# Altium project MiniSTM32.PrjPcb
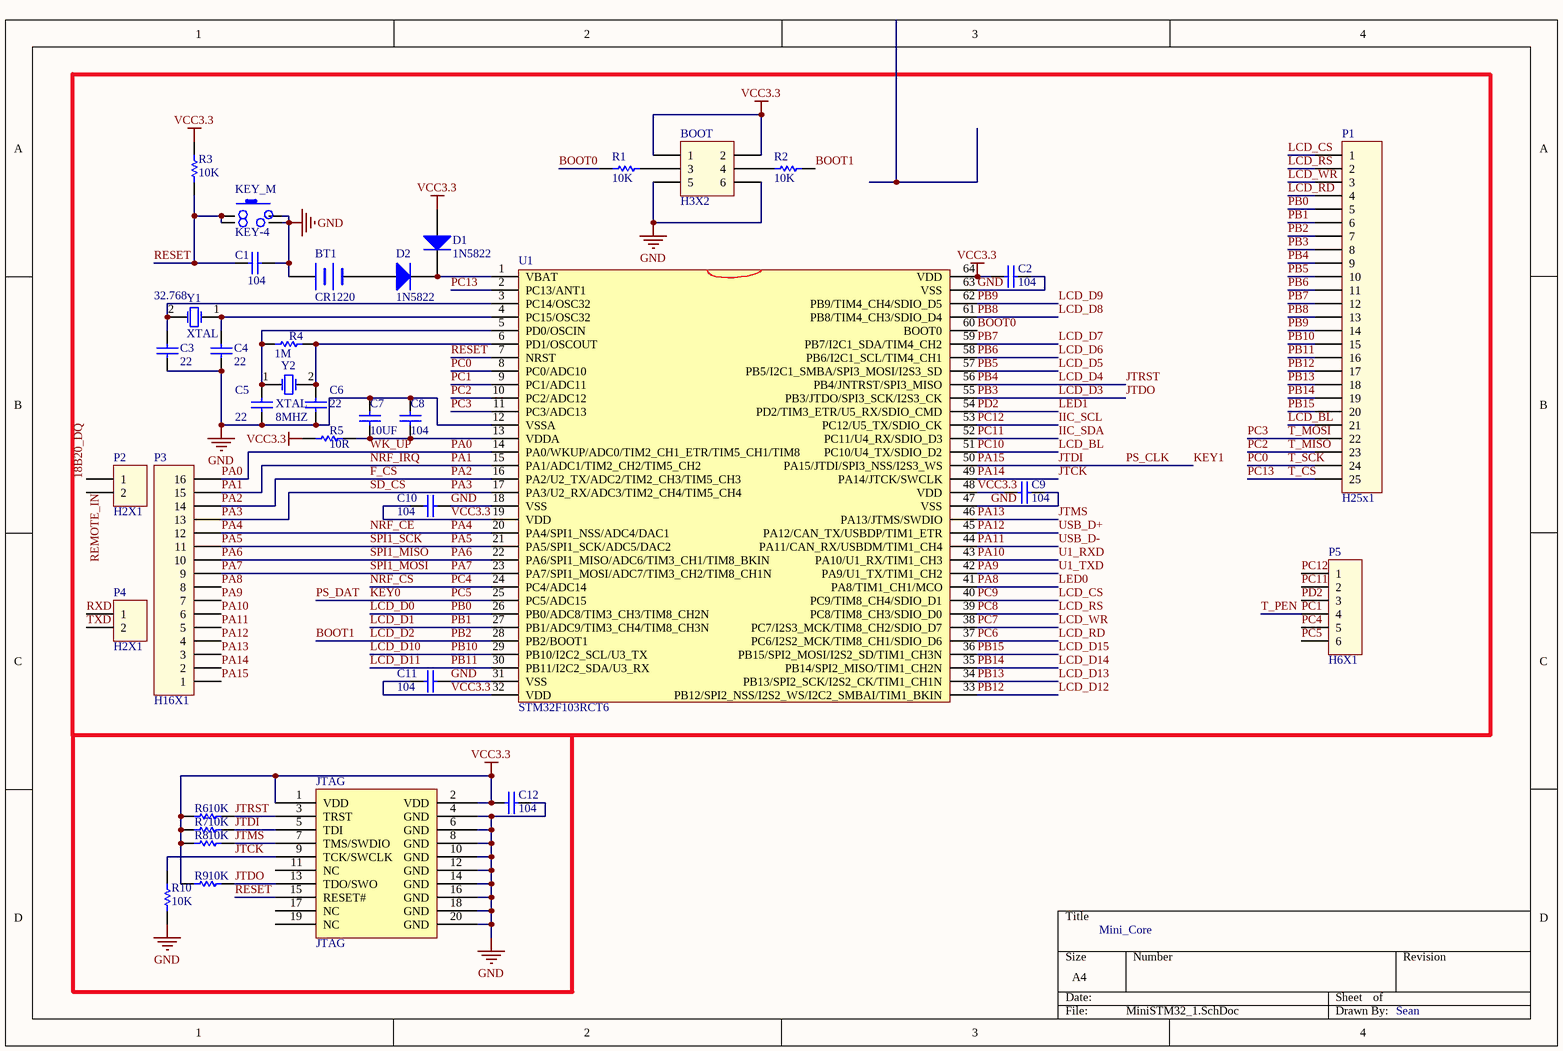
[diagram p0: MiniSTM32_1.SchDoc]
2 sheets, 104 parts. Net scope: global (net labels, ports and power ports of the same name join across sheets).
Board file: MiniSTM32.PcbDoc
Sheets:
  MiniSTM32_1.SchDoc
  MiniSTM32_2.SchDoc

## Sheet MiniSTM32_1.SchDoc: Mini_Core
size A4; DrawnBy: Sean

### Parts
BOOT  H3X2  [H2.54-2X3]
BT1  CR1220  [CR1220]
C1  Cap  [CAP[0603]]  (value not drawn)
C2  Cap  [CAP[0603]]  (value not drawn)
C3  Cap  [CAP[0603]]  (value not drawn)
C4  Cap  [CAP[0603]]  (value not drawn)
C5  Cap  [CAP[0805]]  (value not drawn)
C6  Cap  [CAP[0805]]  (value not drawn)
C7  Cap  [CAP[1206]]  (value not drawn)
C8  Cap  [CAP[0603]]  (value not drawn)
C9  Cap  [CAP[0603]]  (value not drawn)
C10  Cap  [CAP[0603]]  (value not drawn)
C11  Cap  [CAP[0603]]  (value not drawn)
C12  Cap  [CAP[0603]]  (value not drawn)
D1  1N5822  [1N4733]
D2  1N5822  [1N4733]
JTAG  JTAG  [JTAG]
KEY_M  KEY-4  [KEY-4(DIP)]
P1  H25x1  [H2.54-1X25]
P2  H2X1  [H2.54-1X2]
P3  H16X1  [H2.54-1X16]
P4  H2X1  [H2.54-1X2]
P5  H6X1  [H2.54-1X6]
R1  Res  [RES[0603]]  (value not drawn)
R2  Res  [RES[0603]]  (value not drawn)
R3  Res  [RES[0603]]  (value not drawn)
R4  Res  [RES[0603]]  (value not drawn)
R5  Res  [RES[0603]]  (value not drawn)
R6  Res  [RES[0603]]  (value not drawn)
R7  Res  [RES[0603]]  (value not drawn)
R8  Res  [RES[0603]]  (value not drawn)
R9  Res  [RES[0603]]  (value not drawn)
R10  Res  [RES[0603]]  (value not drawn)
U1  STM32F103RCT6  [LQFP-64]
Y1  XTAL  [XTAL-32768_2]
Y2  XTAL  [XTAL]

### Nets
GND: BOOT.5 BOOT.6 BT1.1(+) C1.2 C2.2 C3.1 C4.1 C5.1 C6.1 C7.2 C8.2 C9.2 C10.1 C11.1 C12.1 JTAG.4(GND) JTAG.6(GND) JTAG.8(GND) JTAG.10(GND) JTAG.12(GND) JTAG.14(GND) JTAG.16(GND) JTAG.18(GND) JTAG.20(GND) KEY_M.3 KEY_M.4 R10.2 U1.12(VSSA) U1.18(VSS) U1.31(VSS) U1.47(VSS) U1.63(VSS)
VCC3.3: BOOT.1 BOOT.2 C2.1 C9.1 C10.2 C11.2 C12.2 D1.1(A) JTAG.1(VDD) JTAG.2(VDD) R3.2 R5.2 R6.2 R7.2 R8.2 R9.2 U1.19(VDD) U1.32(VDD) U1.48(VDD) U1.64(VDD)
18B20_DQ: P2.1
BOOT0: R1.1 U1.60(BOOT0)
BOOT1: P1.7 R2.2 U1.28(PB2/BOOT1)  [also labelled LCD_D2, PB2]
F_CS: P3.14 U1.16(PA2/U2_TX/ADC2/TIM2_CH3/TIM5_CH3)  [also labelled PA2]
IIC_SCL: P5.1 U1.53(PC12/U5_TX/SDIO_CK)  [also labelled PC12]
IIC_SDA: P5.2 U1.52(PC11/U4_RX/SDIO_D3)  [also labelled PC11]
JTCK: JTAG.9(TCK/SWCLK) P3.2 R10.1 U1.49(PA14/JTCK/SWCLK)  [also labelled PA14]
JTDI: JTAG.5(TDI) P3.1 R7.1 U1.50(PA15/JTDI/SPI3_NSS/I2S3_WS)  [also labelled KEY1, PA15, PS_CLK]
JTDO: JTAG.13(TDO/SWO) P1.8 R9.1 U1.55(PB3/JTDO/SPI3_SCK/I2S3_CK)  [also labelled LCD_D3, PB3]
JTMS: JTAG.7(TMS/SWDIO) P3.3 R8.1 U1.46(PA13/JTMS/SWDIO)  [also labelled PA13]
JTRST: JTAG.3(TRST) P1.9 R6.1 U1.56(PB4/JNTRST/SPI3_MISO)  [also labelled LCD_D4, PB4]
KEY0: P5.6 U1.25(PC5/ADC15)  [also labelled PC5, PS_DAT]
LCD_BL: P1.21 U1.51(PC10/U4_TX/SDIO_D2)  [also labelled PC10]
LCD_CS: P1.1 U1.40(PC9/TIM8_CH4/SDIO_D1)  [also labelled PC9]
LCD_D0: P1.5 U1.26(PB0/ADC8/TIM3_CH3/TIM8_CH2N)  [also labelled PB0]
LCD_D1: P1.6 U1.27(PB1/ADC9/TIM3_CH4/TIM8_CH3N)  [also labelled PB1]
LCD_D5: P1.10 U1.57(PB5/I2C1_SMBA/SPI3_MOSI/I2S3_SD)  [also labelled PB5]
LCD_D6: P1.11 U1.58(PB6/I2C1_SCL/TIM4_CH1)  [also labelled PB6]
LCD_D7: P1.12 U1.59(PB7/I2C1_SDA/TIM4_CH2)  [also labelled PB7]
LCD_D8: P1.13 U1.61(PB8/TIM4_CH3/SDIO_D4)  [also labelled PB8]
LCD_D9: P1.14 U1.62(PB9/TIM4_CH4/SDIO_D5)  [also labelled PB9]
LCD_D10: P1.15 U1.29(PB10/I2C2_SCL/U3_TX)  [also labelled PB10]
LCD_D11: P1.16 U1.30(PB11/I2C2_SDA/U3_RX)  [also labelled PB11]
LCD_D12: P1.17 U1.33(PB12/SPI2_NSS/I2S2_WS/I2C2_SMBAI/TIM1_BKIN)  [also labelled PB12]
LCD_D13: P1.18 U1.34(PB13/SPI2_SCK/I2S2_CK/TIM1_CH1N)  [also labelled PB13]
LCD_D14: P1.19 U1.35(PB14/SPI2_MISO/TIM1_CH2N)  [also labelled PB14]
LCD_D15: P1.20 U1.36(PB15/SPI2_MOSI/I2S2_SD/TIM1_CH3N)  [also labelled PB15]
LCD_RD: P1.4 U1.37(PC6/I2S2_MCK/TIM8_CH1/SDIO_D6)  [also labelled PC6]
LCD_RS: P1.2 U1.39(PC8/TIM8_CH3/SDIO_D0)  [also labelled PC8]
LCD_WR: P1.3 U1.38(PC7/I2S3_MCK/TIM8_CH2/SDIO_D7)  [also labelled PC7]
LED0: P3.8 U1.41(PA8/TIM1_CH1/MCO)  [also labelled PA8]
LED1: P5.3 U1.54(PD2/TIM3_ETR/U5_RX/SDIO_CMD)  [also labelled PD2]
NRF_CE: P3.12 U1.20(PA4/SPI1_NSS/ADC4/DAC1)  [also labelled PA4]
NRF_CS: P5.5 U1.24(PC4/ADC14)  [also labelled PC4]
NRF_IRQ: P3.15 U1.15(PA1/ADC1/TIM2_CH2/TIM5_CH2)  [also labelled PA1]
PA0: P3.16 U1.14(PA0/WKUP/ADC0/TIM2_CH1_ETR/TIM5_CH1/TIM8)  [also labelled WK_UP]
PA3: P3.13 U1.17(PA3/U2_RX/ADC3/TIM2_CH4/TIM5_CH4)  [also labelled SD_CS]
PA5: P3.11 U1.21(PA5/SPI1_SCK/ADC5/DAC2)  [also labelled SPI1_SCK]
PA6: P3.10 U1.22(PA6/SPI1_MISO/ADC6/TIM3_CH1/TIM8_BKIN)  [also labelled SPI1_MISO]
PA7: P3.9 U1.23(PA7/SPI1_MOSI/ADC7/TIM3_CH2/TIM8_CH1N)  [also labelled SPI1_MOSI]
PA9: P3.7 U1.42(PA9/U1_TX/TIM1_CH2)  [also labelled U1_TXD]
PA10: P3.6 U1.43(PA10/U1_RX/TIM1_CH3)  [also labelled U1_RXD]
PA11: P3.5 U1.44(PA11/CAN_RX/USBDM/TIM1_CH4)  [also labelled USB_D-]
PA12: P3.4 U1.45(PA12/CAN_TX/USBDP/TIM1_ETR)  [also labelled USB_D+]
PC0: P1.24 U1.8(PC0/ADC10)  [also labelled T_SCK]
PC1: P5.4 U1.9(PC1/ADC11)  [also labelled T_PEN]
PC2: P1.23 U1.10(PC2/ADC12)  [also labelled T_MISO]
PC3: P1.22 U1.11(PC3/ADC13)  [also labelled T_MOSI]
PC13: P1.25 U1.2(PC13/ANT1)  [also labelled T_CS]
REMOTE_IN: P2.2
RESET: C1.1 JTAG.15(RESET#) KEY_M.1 KEY_M.2 R3.1 U1.7(NRST)
RXD: P4.1
TXD: P4.2
NetBOOT_3: BOOT.3 R1.2
NetBOOT_4: BOOT.4 R2.1
NetBT1_2: BT1.2(-) D2.1(A)
NetC3_2: C3.2 U1.3(PC14/OSC32) Y1.2(OSC2)
NetC4_2: C4.2 U1.4(PC15/OSC32) Y1.1(OSC1)
NetC5_2: C5.2 R4.2 U1.5(PD0/OSCIN) Y2.1(OSC1)
NetC6_2: C6.2 R4.1 U1.6(PD1/OSCOUT) Y2.2(OSC2)
NetC7_1: C7.1 C8.1 R5.1 U1.13(VDDA)
NetD1_2: D1.2(K) D2.2(K) U1.1(VBAT)

Not connected (* = marked no-connect by the designer): JTAG 11(NC) 17(NC) 19(NC)

### Notes on the sheet
- (in symbol Cap) 104; 22; 10UF
- (in symbol Res) 10K; 1M; 10R
- (in symbol XTAL) 32.768; 8MHZ

### Library data of the parts
BT1 = BATTERY

## Sheet MiniSTM32_2.SchDoc: MIni Device
size A4; DrawnBy: Sean
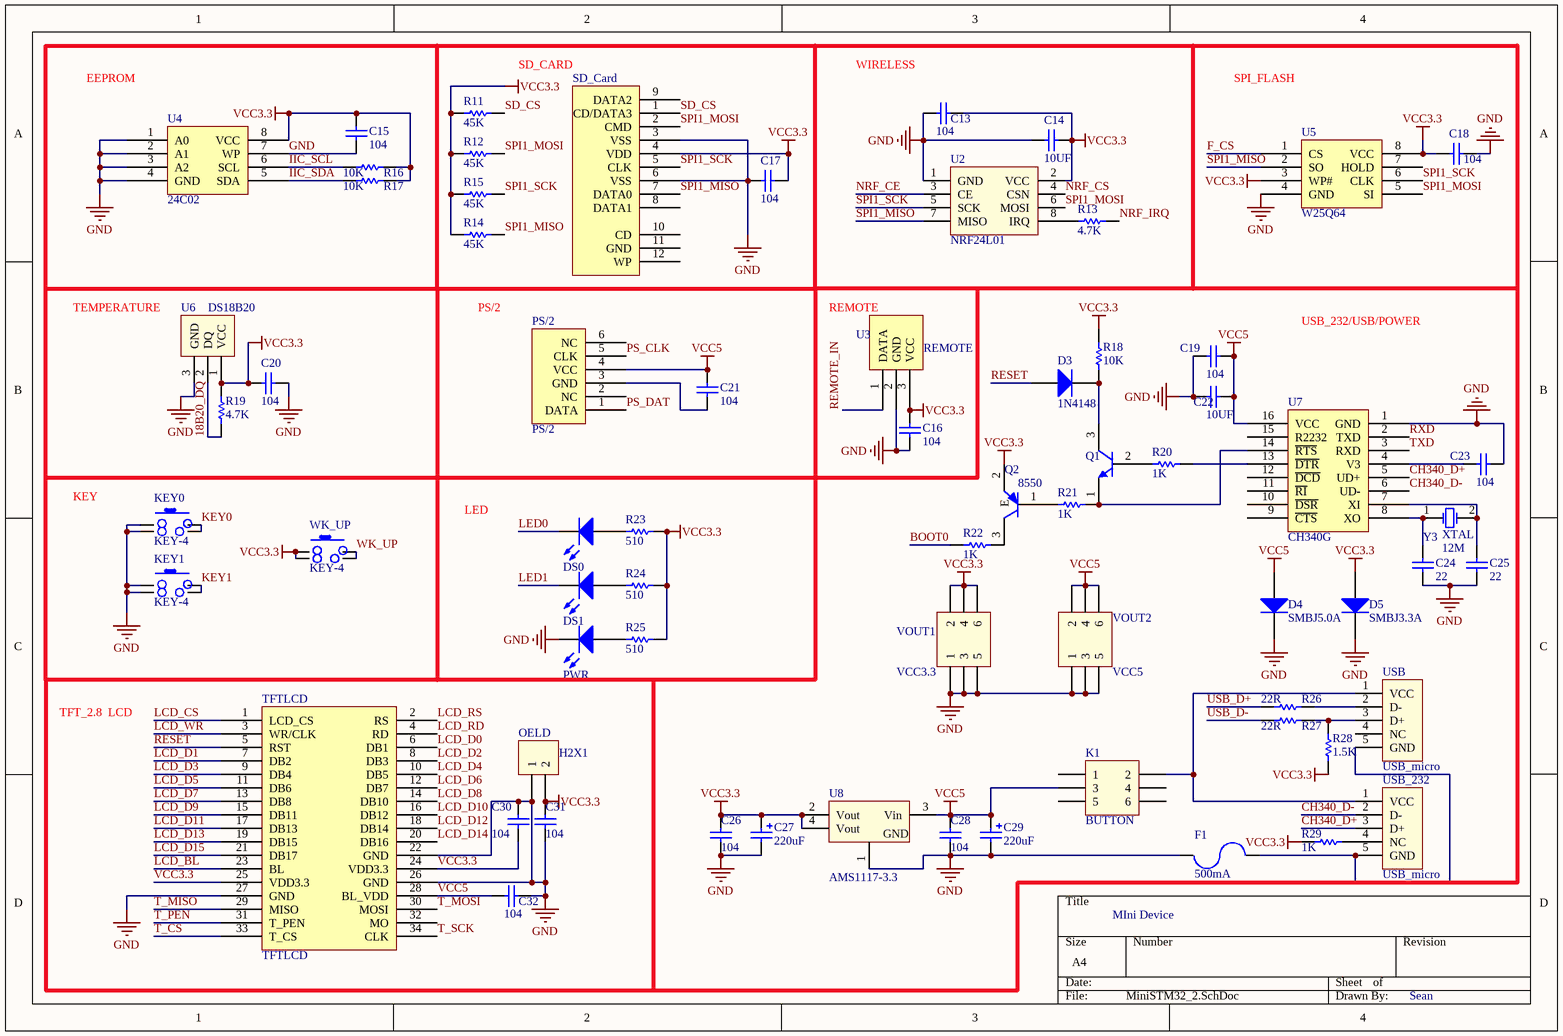
[diagram p1: MiniSTM32_2.SchDoc]

### Parts
C13  Cap  [CAP[0603]]  (value not drawn)
C14  Cap  [CAP[0805]]  (value not drawn)
C15  Cap  [CAP[0603]]  (value not drawn)
C16  Cap  [CAP[0603]]  (value not drawn)
C17  Cap  [CAP[0603]]  (value not drawn)
C18  Cap  [CAP[0603]]  (value not drawn)
C19  Cap  [CAP[0603]]  (value not drawn)
C20  Cap  [CAP[0603]]  (value not drawn)
C21  Cap  [CAP[0603]]  (value not drawn)
C22  Cap  [CAP[1206]]  (value not drawn)
C23  Cap  [CAP[0603]]  (value not drawn)
C24  Cap  [CAP[0805]]  (value not drawn)
C25  Cap  [CAP[0805]]  (value not drawn)
C26  Cap  [CAP[0603]]  (value not drawn)
C27  Cap Pol  [R_6_3_h_7_7]  (value not drawn)
C28  Cap  [CAP[0603]]  (value not drawn)
C29  Cap Pol  [R_6_3_h_7_7]  (value not drawn)
C30  Cap  [CAP[0603]]  (value not drawn)
C31  Cap  [CAP[0603]]  (value not drawn)
C32  Cap  [CAP[0603]]  (value not drawn)
D3  1N4148  [1N4733]
D4  SMBJ5.0A  [1N4733]
D5  SMBJ3.3A  [1N4733]
DS0  LED  [LED[0805]]  (value not drawn)
DS1  LED  [LED[0805]]  (value not drawn)
F1  500mA  [PTC[1206]]
K1  BUTTON  [KEY-6]
KEY0  KEY-4  [KEY-4(DIP)]
KEY1  KEY-4  [KEY-4(DIP)]
OELD  H2X1  [H2.54-1X2(IN)]
PS/2  PS/2  [PS/2]
PWR  LED  [LED[0805]]  (value not drawn)
Q1  9013/8050  [SOT23A]  (value not drawn)
Q2  8550  [SOT23A]
R11  Res  [RES[0603]]  (value not drawn)
R12  Res  [RES[0603]]  (value not drawn)
R13  Res  [RES[0603]]  (value not drawn)
R14  Res  [RES[0603]]  (value not drawn)
R15  Res  [RES[0603]]  (value not drawn)
R16  Res  [RES[0603]]  (value not drawn)
R17  Res  [RES[0603]]  (value not drawn)
R18  Res  [RES[0603]]  (value not drawn)
R19  Res  [RES[0603]]  (value not drawn)
R20  Res  [RES[0603]]  (value not drawn)
R21  Res  [RES[0603]]  (value not drawn)
R22  Res  [RES[0603]]  (value not drawn)
R23  Res  [RES[0603]]  (value not drawn)
R24  Res  [RES[0603]]  (value not drawn)
R25  Res  [RES[0603]]  (value not drawn)
R26  Res  [RES[0603]]  (value not drawn)
R27  Res  [RES[0603]]  (value not drawn)
R28  Res  [RES[0603]]  (value not drawn)
R29  Res  [RES[0603]]  (value not drawn)
SD_Card  SD_Card  [SD_Card]
TFTLCD  TFTLCD  [TFTLCD_2_8]
U2  NRF24L01  [NRF24L01]
U3  REMOTE  [REMOTE]
U4  24C02  [SO-8]
U5  W25Q64  [SO-8]
U6  DS18B20  [H2.54-1X3(RM)]
U7  CH340G  [SO-16]
U8  AMS1117-3.3  [SOT-223(AMS1117-3.3)]
USB  USB_micro  [USB B mini 5pin]
USB_232  USB_micro  [USB B mini 5pin]
VOUT1  VCC3.3  [H2.54-2X3]
VOUT2  VCC5  [H2.54-2X3]
WK_UP  KEY-4  [KEY-4(DIP)]
Y3  XTAL  [XTAL]

### Nets
GND: C13.1 C14.1 C15.1 C16.1 C17.1 C18.2 C19.1 C20.2 C22.1 C23.2 C24.1 C25.1 C26.2 C27.2 C28.2 C29.2 C30.2 C31.1 C32.1 D4.2(K) D5.2(K) F1.1 KEY0.1 KEY0.2 KEY1.1 KEY1.2 OELD.1 PWR.2(K) SD_Card.3(VSS) SD_Card.6(VSS) TFTLCD.22(GND) TFTLCD.26(GND) TFTLCD.27(GND) U2.1(GND) U3.2(GND) U4.1(A0) U4.2(A1) U4.3(A2) U4.4(GND) U4.7(WP) U5.4(GND) U6.3(GND) U7.1(GND) U8.1(GND) VOUT1.1 VOUT1.3 VOUT1.5 VOUT2.1 VOUT2.3 VOUT2.5
VCC3.3: C13.2 C14.2 C15.2 C16.2 C17.2 C18.1 C20.1 C26.1 C27.1 C30.1 C31.2 D5.1(A) OELD.2 Q2.2(E) R11.1 R12.1 R14.1 R15.1 R16.2 R17.2 R18.2 R19.2 R23.2 R24.2 R25.2 R28.1 R29.1 SD_Card.4(VDD) TFTLCD.24(VDD3.3) TFTLCD.25(VDD3.3) U2.2(VCC) U3.3(VCC) U4.8(VCC) U5.3(WP#) U5.8(VCC) U6.1(VCC) U8.2(Vout) U8.4(Vout) VOUT1.2 VOUT1.4 VOUT1.6 WK_UP.1 WK_UP.2
VCC5: C19.2 C21.2 C22.2 C28.1 C29.1 C32.2 D4.1(A) K1.3 PS/2.4(VCC) TFTLCD.28(BL_VDD) U7.16(VCC) U8.3(Vin) VOUT2.2 VOUT2.4 VOUT2.6
18B20_DQ: R19.1 U6.2(DQ)
BOOT0: R22.1
CH340_D+: U7.5(UD+) USB_232.3(D+)
CH340_D-: U7.6(UD-) USB_232.2(D-)
F_CS: U5.1(CS)
IIC_SCL: R16.1 U4.6(SCL)
IIC_SDA: R17.1 U4.5(SDA)
KEY0: KEY0.3 KEY0.4 PS/2.1(DATA)  [also labelled PS_DAT]
KEY1: KEY1.3 KEY1.4 PS/2.5(CLK)  [also labelled PS_CLK]  [project net JTDI]
LCD_BL: TFTLCD.23(BL)
LCD_CS: TFTLCD.1(LCD_CS)
LCD_D0: TFTLCD.6(DB1)
LCD_D1: TFTLCD.7(DB2)
LCD_D2: TFTLCD.8(DB3)  [project net BOOT1]
LCD_D3: TFTLCD.9(DB4)  [project net JTDO]
LCD_D4: TFTLCD.10(DB5)  [project net JTRST]
LCD_D5: TFTLCD.11(DB6)
LCD_D6: TFTLCD.12(DB7)
LCD_D7: TFTLCD.13(DB8)
LCD_D8: TFTLCD.14(DB10)
LCD_D9: TFTLCD.15(DB11)
LCD_D10: TFTLCD.16(DB12)
LCD_D11: TFTLCD.17(DB13)
LCD_D12: TFTLCD.18(DB14)
LCD_D13: TFTLCD.19(DB15)
LCD_D14: TFTLCD.20(DB16)
LCD_D15: TFTLCD.21(DB17)
LCD_RD: TFTLCD.4(RD)
LCD_RS: TFTLCD.2(RS)
LCD_WR: TFTLCD.3(WR/CLK)
LED0: DS0.2(K)
LED1: DS1.2(K)
NRF_CE: U2.3(CE)
NRF_CS: U2.4(CSN)
NRF_IRQ: R13.2
REMOTE_IN: U3.1(DATA)
RESET: D3.1 TFTLCD.5(RST)
RXD: U7.2(TXD)
SD_CS: R11.2 SD_Card.1(CD/DATA3)  [project net PA3]
SPI1_MISO: R14.2 SD_Card.7(DATA0) U2.7(MISO) U5.2(SO)  [project net PA6]
SPI1_MOSI: R12.2 SD_Card.2(CMD) U2.6(MOSI) U5.5(SI)  [project net PA7]
SPI1_SCK: R15.2 SD_Card.5(CLK) U2.5(SCK) U5.6(CLK)  [project net PA5]
T_CS: TFTLCD.33(T_CS)  [project net PC13]
T_MISO: TFTLCD.29(MISO)  [project net PC2]
T_MOSI: TFTLCD.30(MOSI)  [project net PC3]
T_PEN: TFTLCD.31(T_PEN)  [project net PC1]
T_SCK: TFTLCD.34(CLK)  [project net PC0]
TXD: U7.3(RXD)
USB_D+: R26.1  [project net PA12]
USB_D-: R27.1  [project net PA11]
WK_UP: WK_UP.3 WK_UP.4  [project net PA0]
NetC21_1: C21.1 PS/2.3(GND)
NetC23_1: C23.1 U7.4(V3)
NetC24_2: C24.2 U7.8(XO) Y3.1(OSC1)
NetC25_2: C25.2 U7.7(XI) Y3.2(OSC2)
NetD3_2: D3.2 Q1.3(C) R18.1
NetDS0_1: DS0.1(A) R23.1
NetDS1_1: DS1.1(A) R24.1
NetF1_2: F1.2 USB.5(GND) USB_232.5(GND)
NetK1_2: K1.2 USB.1(VCC) USB_232.1(VCC)
NetPWR_1: PWR.1(A) R25.1
NetQ1_1: Q1.1(E) R21.2 U7.14(~{RTS})
NetQ1_2: Q1.2(B) R20.1
NetQ2_1: Q2.1(B) R21.1
NetQ2_3: Q2.3(C) R22.2
NetR13_1: R13.1 U2.8(IRQ)
NetR20_2: R20.2 U7.13(~{DTR})
NetR26_2: R26.2 USB.2(D-)
NetR27_2: R27.2 R28.2 USB.3(D+)
NetR29_2: R29.2 USB_232.4(NC)

Not connected (* = marked no-connect by the designer): K1 1 4 5 6; PS/2 2(NC) 6(NC); SD_Card 8(DATA1) 9(DATA2) 10(CD) 11(GND) 12(WP); TFTLCD 32(MO); U5 7(HOLD); U7 9(~{CTS}) 10(~{DSR}) 11(~{RI}) 12(~{DCD}) 15(R2232); USB 4(NC)

### Notes on the sheet
- EEPROM
- (near R11) SD_CARD
- (near C13) WIRELESS
- SPI_FLASH
- TEMPERATURE
- PS/2
- REMOTE
- USB_232/USB/POWER
- KEY
- LED
- TFT_2.8  LCD
- (in symbol Cap) 104; 10UF; 22
- (in symbol Cap Pol) 220uF
- (in symbol Res) 10K; 4.7K; 1K; 22R; 1.5K; 510; 45K
- (in symbol XTAL) 12M

### Library data of the parts
D4 D5 = 1N5822
F1 = PTC
K1 VOUT1 VOUT2 = H3X2
Q2 = 9012/8550

## Nets that join several sheets
GND: MiniSTM32_1 (32 pins), MiniSTM32_2 (50 pins)
VCC3.3: MiniSTM32_1 (20 pins), MiniSTM32_2 (43 pins)
18B20_DQ: MiniSTM32_1 (P2.1), MiniSTM32_2 (R19.1 U6.2)
BOOT0: MiniSTM32_1 (R1.1 U1.60), MiniSTM32_2 (R22.1)
BOOT1: MiniSTM32_1 (P1.7 R2.2 U1.28), MiniSTM32_2 (TFTLCD.8)
F_CS: MiniSTM32_1 (P3.14 U1.16), MiniSTM32_2 (U5.1)
IIC_SCL: MiniSTM32_1 (P5.1 U1.53), MiniSTM32_2 (R16.1 U4.6)
IIC_SDA: MiniSTM32_1 (P5.2 U1.52), MiniSTM32_2 (R17.1 U4.5)
JTDI: MiniSTM32_1 (JTAG.5 P3.1 R7.1 U1.50), MiniSTM32_2 (KEY1.3 KEY1.4 PS/2.5)
JTDO: MiniSTM32_1 (JTAG.13 P1.8 R9.1 U1.55), MiniSTM32_2 (TFTLCD.9)
JTRST: MiniSTM32_1 (JTAG.3 P1.9 R6.1 U1.56), MiniSTM32_2 (TFTLCD.10)
KEY0: MiniSTM32_1 (P5.6 U1.25), MiniSTM32_2 (KEY0.3 KEY0.4 PS/2.1)
LCD_BL: MiniSTM32_1 (P1.21 U1.51), MiniSTM32_2 (TFTLCD.23)
LCD_CS: MiniSTM32_1 (P1.1 U1.40), MiniSTM32_2 (TFTLCD.1)
LCD_D0: MiniSTM32_1 (P1.5 U1.26), MiniSTM32_2 (TFTLCD.6)
LCD_D1: MiniSTM32_1 (P1.6 U1.27), MiniSTM32_2 (TFTLCD.7)
LCD_D5: MiniSTM32_1 (P1.10 U1.57), MiniSTM32_2 (TFTLCD.11)
LCD_D6: MiniSTM32_1 (P1.11 U1.58), MiniSTM32_2 (TFTLCD.12)
LCD_D7: MiniSTM32_1 (P1.12 U1.59), MiniSTM32_2 (TFTLCD.13)
LCD_D8: MiniSTM32_1 (P1.13 U1.61), MiniSTM32_2 (TFTLCD.14)
LCD_D9: MiniSTM32_1 (P1.14 U1.62), MiniSTM32_2 (TFTLCD.15)
LCD_D10: MiniSTM32_1 (P1.15 U1.29), MiniSTM32_2 (TFTLCD.16)
LCD_D11: MiniSTM32_1 (P1.16 U1.30), MiniSTM32_2 (TFTLCD.17)
LCD_D12: MiniSTM32_1 (P1.17 U1.33), MiniSTM32_2 (TFTLCD.18)
LCD_D13: MiniSTM32_1 (P1.18 U1.34), MiniSTM32_2 (TFTLCD.19)
LCD_D14: MiniSTM32_1 (P1.19 U1.35), MiniSTM32_2 (TFTLCD.20)
LCD_D15: MiniSTM32_1 (P1.20 U1.36), MiniSTM32_2 (TFTLCD.21)
LCD_RD: MiniSTM32_1 (P1.4 U1.37), MiniSTM32_2 (TFTLCD.4)
LCD_RS: MiniSTM32_1 (P1.2 U1.39), MiniSTM32_2 (TFTLCD.2)
LCD_WR: MiniSTM32_1 (P1.3 U1.38), MiniSTM32_2 (TFTLCD.3)
LED0: MiniSTM32_1 (P3.8 U1.41), MiniSTM32_2 (DS0.2)
LED1: MiniSTM32_1 (P5.3 U1.54), MiniSTM32_2 (DS1.2)
NRF_CE: MiniSTM32_1 (P3.12 U1.20), MiniSTM32_2 (U2.3)
NRF_CS: MiniSTM32_1 (P5.5 U1.24), MiniSTM32_2 (U2.4)
NRF_IRQ: MiniSTM32_1 (P3.15 U1.15), MiniSTM32_2 (R13.2)
PA0: MiniSTM32_1 (P3.16 U1.14), MiniSTM32_2 (WK_UP.3 WK_UP.4)
PA3: MiniSTM32_1 (P3.13 U1.17), MiniSTM32_2 (R11.2 SD_Card.1)
PA5: MiniSTM32_1 (P3.11 U1.21), MiniSTM32_2 (R15.2 SD_Card.5 U2.5 U5.6)
PA6: MiniSTM32_1 (P3.10 U1.22), MiniSTM32_2 (R14.2 SD_Card.7 U2.7 U5.2)
PA7: MiniSTM32_1 (P3.9 U1.23), MiniSTM32_2 (R12.2 SD_Card.2 U2.6 U5.5)
PA11: MiniSTM32_1 (P3.5 U1.44), MiniSTM32_2 (R27.1)
PA12: MiniSTM32_1 (P3.4 U1.45), MiniSTM32_2 (R26.1)
PC0: MiniSTM32_1 (P1.24 U1.8), MiniSTM32_2 (TFTLCD.34)
PC1: MiniSTM32_1 (P5.4 U1.9), MiniSTM32_2 (TFTLCD.31)
PC2: MiniSTM32_1 (P1.23 U1.10), MiniSTM32_2 (TFTLCD.29)
PC3: MiniSTM32_1 (P1.22 U1.11), MiniSTM32_2 (TFTLCD.30)
PC13: MiniSTM32_1 (P1.25 U1.2), MiniSTM32_2 (TFTLCD.33)
REMOTE_IN: MiniSTM32_1 (P2.2), MiniSTM32_2 (U3.1)
RESET: MiniSTM32_1 (6 pins), MiniSTM32_2 (D3.1 TFTLCD.5)
RXD: MiniSTM32_1 (P4.1), MiniSTM32_2 (U7.2)
TXD: MiniSTM32_1 (P4.2), MiniSTM32_2 (U7.3)